# EAGLE schematic PIC32 (EAGLE 9.3.2)
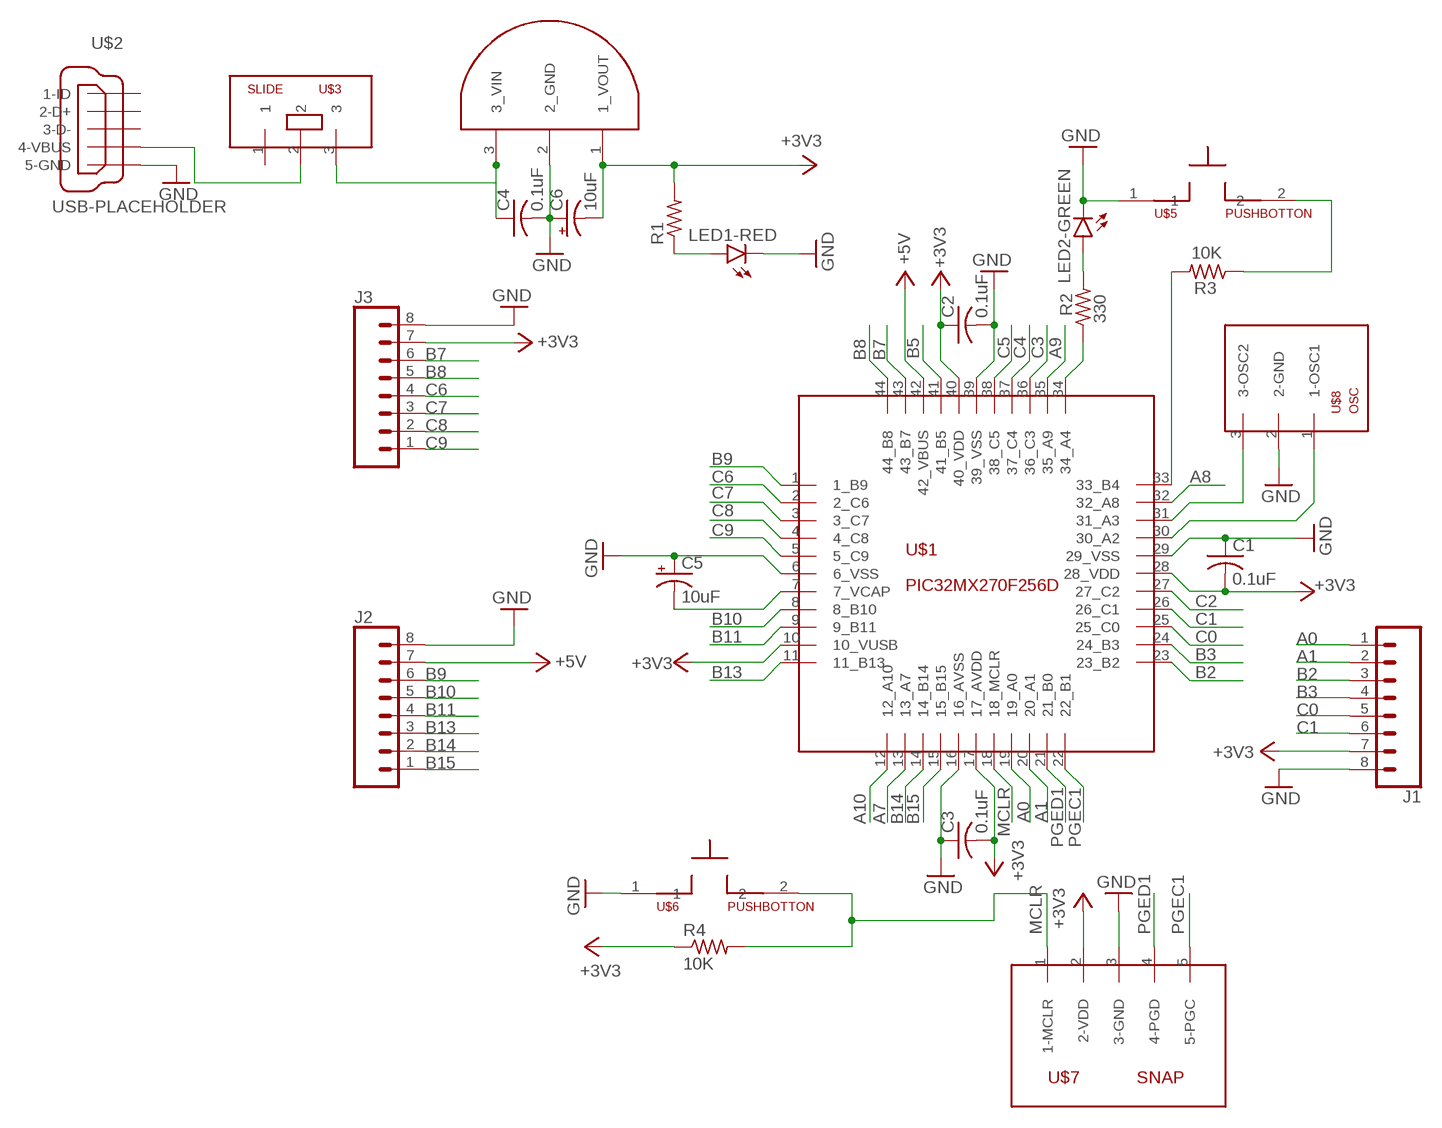
[diagram p0: schematic, sheet 1]

## Parts
C1  0.1uF  C-US025-025X050  [C025-025X050]
C2  0.1uF  C-US025-025X050  [C025-025X050]
C3  0.1uF  C-US025-025X050  [C025-025X050]
C4  0.1uF  C-US025-025X050  [C025-025X050]
C5  10uF  CPOL-USB45181B  [B45181B]
C6  10uF  CPOL-USB45181B  [B45181B]
J1  CONN_08"  [1X08]
J2  CONN_08"  [1X08]
J3  CONN_08"  [1X08]
LED1-RED  LED3MM  [LED3MM]
LED2-GREEN  LED3MM  [LED3MM]
R1  R-US_0207/10  [0207/10]
R2  330  R-US_0207/10  [0207/10]
R3  10K  R-US_0207/10  [0207/10]
R4  10K  R-US_0207/10  [0207/10]
U$1  PIC32MX270F256D  [TQFP44]
U$2  USB-PLACEHOLDER  [USB-B-MICRO-SMD_V04]
U$3  SLIDE  [SLIDE]
U$4  L4931  [TO92-]
U$5  PUSHBOTTON  [PUSHBOTTON]
U$6  PUSHBOTTON  [PUSHBOTTON]
U$7  SNAP  [1X05]
U$8  OSC  [OSC]

## Nets
+3V3: C1.2 C2.1 C3.2 C6.- J1.7 J3.7 R1.2 R4.1 U$1.10(10_VUSB) U$1.17(17_AVDD) U$1.28(28_VDD) U$1.40(40_VDD) U$4.1(1_VOUT) U$7.2(2-VDD)
+5V: J2.7 U$1.42(42_VBUS)
A0: J1.1 U$1.19(19_A0)
A1: J1.2 U$1.20(20_A1)
A7: U$1.13(13_A7)
A8: U$1.32(32_A8)
A9: U$1.35(35_A9)
A10: U$1.12(12_A10)
B2: J1.3 U$1.23(23_B2)
B3: J1.4 U$1.24(24_B3)
B5: U$1.41(41_B5)
B7: J3.6 U$1.43(43_B7)
B8: J3.5 U$1.44(44_B8)
B9: J2.6 U$1.1(1_B9)
B10: J2.5 U$1.8(8_B10)
B11: J2.4 U$1.9(9_B11)
B13: J2.3 U$1.11(11_B13)
B14: J2.2 U$1.14(14_B14)
B15: J2.1 U$1.15(15_B15)
C0: J1.5 U$1.25(25_C0)
C1: J1.6 U$1.26(26_C1)
C2: U$1.27(27_C2)
C3: U$1.36(36_C3)
C4: U$1.37(37_C4)
C5: U$1.38(38_C5)
C6: J3.4 U$1.2(2_C6)
C7: J3.3 U$1.3(3_C7)
C8: J3.2 U$1.4(4_C8)
C9: J3.1 U$1.5(5_C9)
GND: C1.1 C2.2 C3.1 C4.2 C5.+ C6.+ J1.8 J2.8 J3.8 LED1-RED.K(C) LED2-GREEN.K(C) U$1.6(6_VSS) U$1.16(16_AVSS) U$1.29(29_VSS) U$1.39(39_VSS) U$2.VBUS1(5-GND) U$4.2(2_GND) U$5.1 U$6.1 U$7.3(3-GND) U$8.2(2-GND)
MCLR: R4.2 U$1.18(18_MCLR) U$6.2 U$7.1(1-MCLR)
N$1: U$2.ID1(4-VBUS) U$3.2
N$2: C5.- U$1.7(7_VCAP)
N$3: C4.1 U$3.3 U$4.3(3_VIN)
N$4: LED1-RED.A R1.1
N$5: U$1.31(31_A3) U$8.3(3-OSC2)
N$6: U$1.30(30_A2) U$8.1(1-OSC1)
N$7: R3.2 U$1.33(33_B4)
N$8: R3.1 U$5.2
N$9: R2.1 U$1.34(34_A4)
N$10: LED2-GREEN.A R2.2
PGEC1: U$1.22(22_B1) U$7.5(5-PGC)
PGED1: U$1.21(21_B0) U$7.4(4-PGD)
Unconnected: U$2.D+1(1-ID) U$2.D-1(2-D+) U$2.GND1(3-D-) U$3.1

## Library data of the parts
C1-C4 = Parts:C-US: CAPACITOR, American symbol; SPICEPREFIX: C
C5 C6 = Parts:CPOL-US: POLARIZED CAPACITOR, American symbol; SPICEPREFIX: C
J1-J3 = Parts:CONN_08: Multi connection point. Often used as Generic Header-pin footprint for 0.1 inch spaced/style header connections On any of the 0.1 inch spaced packages, you can populate with these: Break Away Headers - Straight <https://www.sparkfun.com/products/116> (PRT-00116) Break Away Male Headers - Right Angle <https://www.sparkfun.com/products/553> (PRT-00553) Female Headers <https://www.sparkfun.com/products/115> (PRT-00115) Break Away Headers - Machine Pin <https://www.sparkfun.com/products/117> (PRT-00117) Break Away Female Headers - Swiss Machine Pin <https://www.sparkfun.com/products/743> (PRT-00743) Arduino Stackable Header - 8 Pin <https://www.sparkfun.com/products/9279> (PRT-09279) For SCREWTERMINALS and SPRING TERMINALS visit here: Screw Terimnals on SparkFun.com <https://www.sparkfun.com/search/results?term=Screw+Terminals> (5mm/3.5mm/2.54mm spacing) This device is also useful as a general connection point to wire up your design to another part of your project. Our various solder wires solder well into these plated through hole pads. Hook-Up Wire - Assortment (Stranded, 22 AWG) <https://www.sparkfun.com/products/11375> (PRT-11375) Hook-Up Wire - Assortment (Solid Core, 22 AWG) <https://www.sparkfun.com/products/11367> (PRT-11367) View the entire wire category on our website here <https://www.sparkfun.com/categories/141> Special notes: Molex polarized connector foot print use with SKU : PRT-08231 with associated crimp pins and housings. 1MM SMD Version SKU: PRT-10208 NOTES ON THE VARIANTS LOCK and LOCK_LONGPADS... This footprint was designed to help hold the alignment of a through-hole component (i.e. 6-pin header) while soldering it into place. You may notice that each hole has been shifted either up or down by 0.005 of an inch from it's more standard position (which is a perfectly straight line). This slight alteration caused the pins (the squares in the middle) to touch the edges of the holes. Because they are alternating, it causes a "brace" to hold the component in place. 0.005 has proven to be the perfect amount of "off-center" position when using our standard breakaway headers. Although looks a little odd when you look at the bare footprint, once you have a header in there, the alteration is very hard to notice. Also,if you push a header all the way into place, it is covered up entirely on the bottom side.; PROD_ID: CONN-08438
LED1-RED LED2-GREEN = Parts:LED: LED OSRAM: - CHIPLED LG R971, LG N971, LY N971, LG Q971, LY Q971, LO R971, LY R971 LH N974, LH R974 LS Q976, LO Q976, LY Q976 LO Q996 - Hyper CHIPLED LW Q18S LB Q993, LB Q99A, LB R99A - SideLED LS A670, LO A670, LY A670, LG A670, LP A670 LB A673, LV A673, LT A673, LW A673 LH A674 LY A675 LS A676, LA A676, LO A676, LY A676, LW A676 LS A679, LY A679, LG A679 - Hyper Micro SIDELED® LS Y876, LA Y876, LO Y876, LY Y876 LT Y87S - SmartLED LW L88C, LW L88S LB L89C, LB L89S, LG L890 LS L89K, LO L89K, LY L89K LS L896, LA L896, LO L896, LY L896 - TOPLED LS T670, LO T670, LY T670, LG T670, LP T670 LSG T670, LSP T670, LSY T670, LOP T670, LYG T670 LG T671, LOG T671, LSG T671 LB T673, LV T673, LT T673, LW T673 LH T674 LS T676, LA T676, LO T676, LY T676, LB T676, LH T676, LSB T676, LW T676 LB T67C, LV T67C, LT T67C, LS T67K, LO T67K, LY T67K, LW E67C LS E67B, LA E67B, LO E67B, LY E67B, LB E67C, LV E67C, LT E67C LW T67C LS T679, LY T679, LG T679 LS T770, LO T770, LY T770, LG T770, LP T770 LB T773, LV T773, LT T773, LW T773 LH T774 LS E675, LA E675, LY E675, LS T675 LS T776, LA T776, LO T776, LY T776, LB T776 LHGB T686 LT T68C, LB T68C - Hyper Mini TOPLED® LB M676 - Mini TOPLED Santana® LG M470 LS M47K, LO M47K, LY M47K Source: http://www.osram.convergy.de LUXEON: - LUMILED® LXK2-PW12-R00, LXK2-PW12-S00, LXK2-PW14-U00, LXK2-PW14-V00 LXK2-PM12-R00, LXK2-PM12-S00, LXK2-PM14-U00 LXK2-PE12-Q00, LXK2-PE12-R00, LXK2-PE12-S00, LXK2-PE14-T00, LXK2-PE14-U00 LXK2-PB12-K00, LXK2-PB12-L00, LXK2-PB12-M00, LXK2-PB14-N00, LXK2-PB14-P00, LXK2-PB14-Q00 LXK2-PR12-L00, LXK2-PR12-M00, LXK2-PR14-Q00, LXK2-PR14-R00 LXK2-PD12-Q00, LXK2-PD12-R00, LXK2-PD12-S00 LXK2-PH12-R00, LXK2-PH12-S00 LXK2-PL12-P00, LXK2-PL12-Q00, LXK2-PL12-R00 Source: www.luxeon.com KINGBRIGHT: KA-3528ASYC Source: www.kingbright.com
R1-R4 = Parts:R-US_: RESISTOR, American symbol; SPICEPREFIX: R
U$1 = Parts:PIC32MX270F256D
U$2 = Parts:USB-PLACEHOLDER
U$3 = Parts:SLIDE
U$4 = Parts:L4931
U$5 U$6 = Parts:PUSHBOTTON
U$7 = Parts:SNAP
U$8 = Parts:OSC